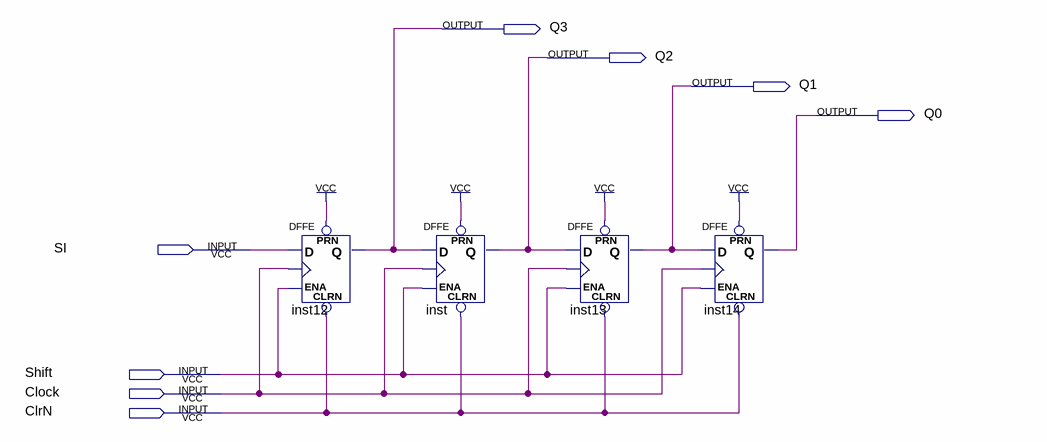
[diagram p0: schematic sheet]
// Quartus schematic SISO_Register.bdf as structural Verilog: 4 symbols, 8 pins
module SISO_Register (
  input  SI,
  input  Shift,
  input  Clock,
  input  ClrN,
  output Q3,
  output Q2,
  output Q1,
  output Q0
);

  DFFE inst12 (.PRN(1'b1), .CLRN(ClrN), .D(SI), .CLK(Clock), .ENA(Shift), .Q(Q3));
  DFFE inst (.PRN(1'b1), .CLRN(ClrN), .D(Q3), .CLK(Clock), .ENA(Shift), .Q(Q2));
  DFFE inst13 (.PRN(1'b1), .CLRN(ClrN), .D(Q2), .CLK(Clock), .ENA(Shift), .Q(Q1));
  DFFE inst14 (.PRN(1'b1), .CLRN(ClrN), .D(Q1), .CLK(Clock), .ENA(Shift), .Q(Q0));
endmodule
